# Altium project AuxillaryTester.PrjPcb
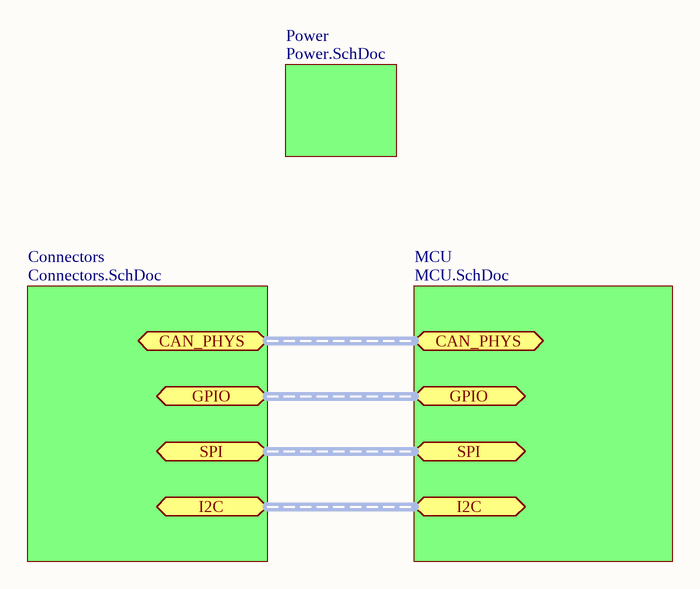
[diagram p0: Main.SchDoc]
4 sheets, 40 parts. Net scope: flat (ports and power ports of the same name join across sheets).
Board file: AuxTester.PcbDoc
Sheets:
  Main.SchDoc
    MCU = MCU.SchDoc
    Connectors = Connectors.SchDoc
    Power = Power.SchDoc

## Sheet Main.SchDoc
size Letter

### Sub-sheets
Connectors = Connectors.SchDoc: no entries
MCU = MCU.SchDoc: no entries
Power = Power.SchDoc: no entries

### Ports
CAN_PHYS (harness CAN_PHYS), GPIO (harness GPIO), I2C (harness I2C), SPI (harness SPI)

## Sheet MCU.SchDoc
size Letter
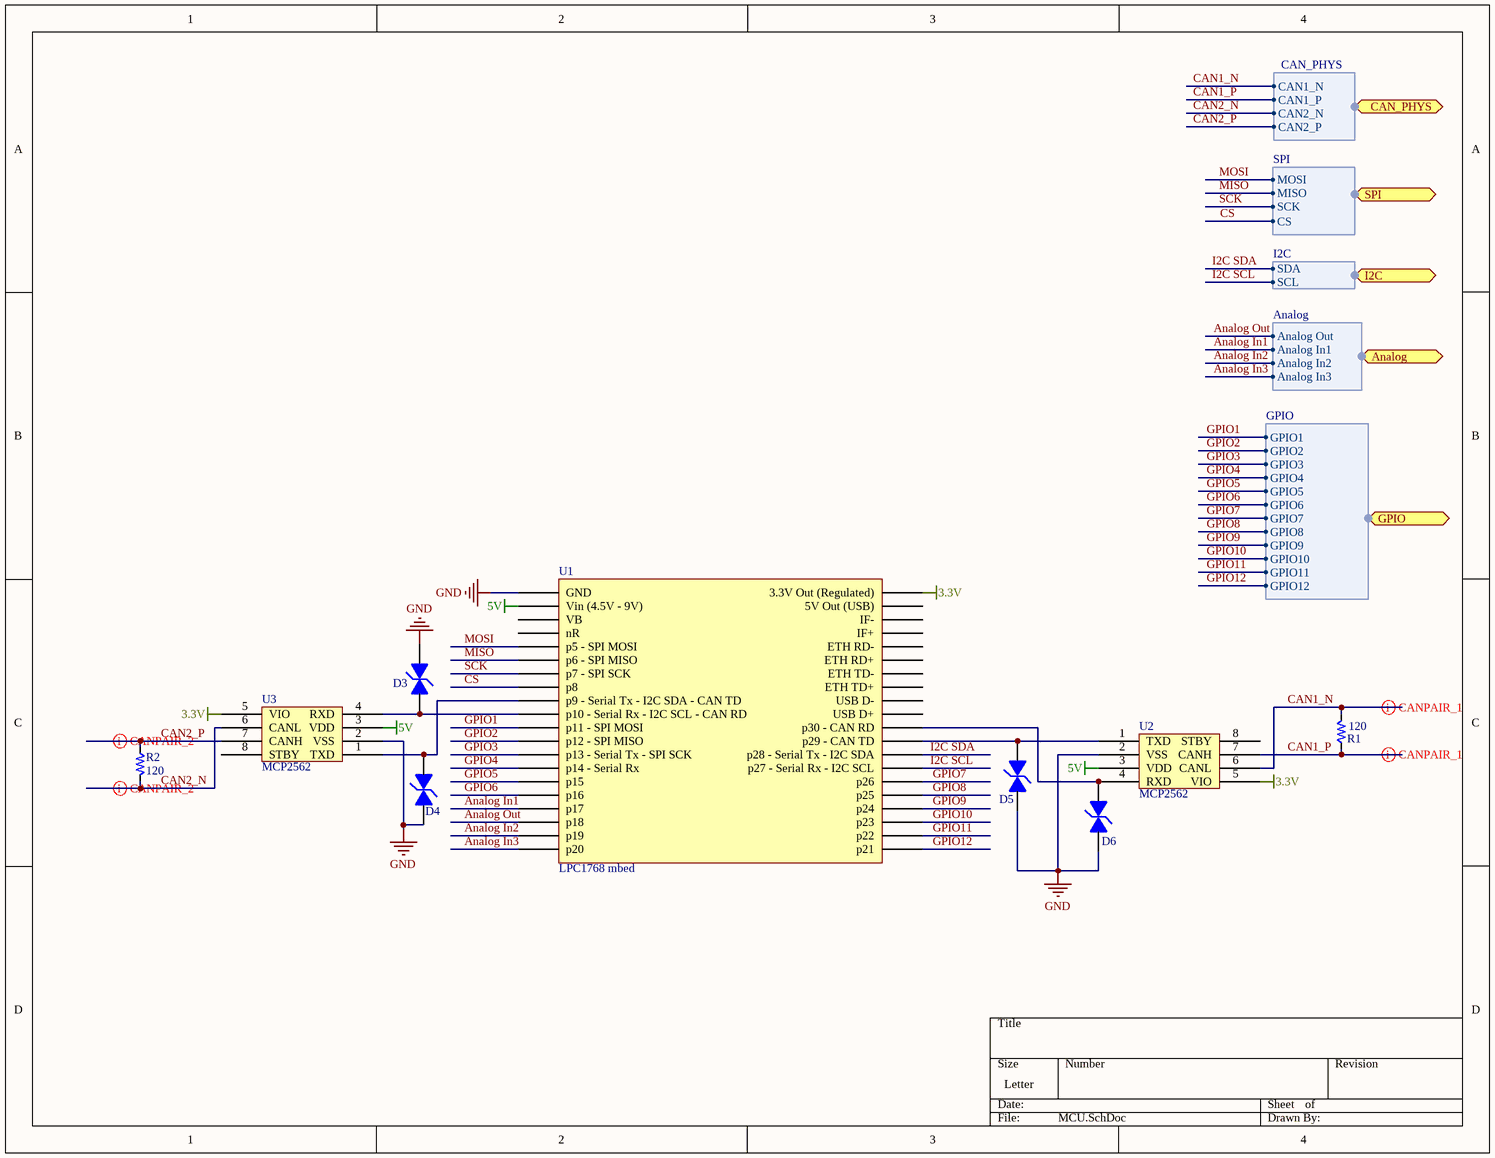
[diagram p1: MCU.SchDoc]

### Parts
D3  TVS Diode  [TVS Diode]  (value not drawn)
D4  TVS Diode  [TVS Diode]  (value not drawn)
D5  TVS Diode  [TVS Diode]  (value not drawn)
D6  TVS Diode  [TVS Diode]  (value not drawn)
R1  120  [PCB_GENERIC_SMD_0603]
R2  120  [PCB_GENERIC_SMD_0603]
U1  LPC1768 mbed  [LPC 1768 mbed Layout]
U2  MCP2562  [MCP2562]
U3  MCP2562  [MCP2562]

### Ports
Analog (harness Analog), CAN_PHYS (harness CAN_PHYS), GPIO (harness GPIO), I2C (harness I2C), SPI (harness SPI)

### Harnesses
CAN_PHYS: CAN1_N, CAN1_P, CAN2_N, CAN2_P
SPI: MOSI, MISO, SCK, CS
I2C: SDA, SCL
GPIO: GPIO1, GPIO2, GPIO3, GPIO4, GPIO5, GPIO6, GPIO7, GPIO8, GPIO9, GPIO10, GPIO11, GPIO12
Analog: Analog Out, Analog In1, Analog In2, Analog In3

### Nets
3.3V: U1.40(3.3V_Out_(Regulated)) U2.5(VIO) U3.5(VIO)
5V: U1.2(Vin_(4.5V_-_9V)) U2.3(VDD) U3.3(VDD)
GND: D3.2 D4.2 D5.1 D6.1 U1.1(GND) U2.2(VSS) U3.2(VSS)
Analog In1: U1.17(p17) ; port Analog.Analog In1
Analog In2: U1.19(p19) ; port Analog.Analog In2
Analog In3: U1.20(p20) ; port Analog.Analog In3
Analog Out: U1.18(p18) ; port Analog.Analog Out
CAN1_N: R1.2 U2.6(CANL) ; port CAN_PHYS.CAN1_N
CAN1_P: R1.1 U2.7(CANH) ; port CAN_PHYS.CAN1_P
CAN2_N: R2.2 U3.6(CANL) ; port CAN_PHYS.CAN2_N
CAN2_P: R2.1 U3.7(CANH) ; port CAN_PHYS.CAN2_P
CS: U1.8(p8) ; port SPI.CS
GPIO1: U1.11(p11_-_SPI_MOSI) ; port GPIO.GPIO1
GPIO2: U1.12(p12_-_SPI_MISO) ; port GPIO.GPIO2
GPIO3: U1.13(p13_-_Serial_Tx_-_SPI_SCK) ; port GPIO.GPIO3
GPIO4: U1.14(p14_-_Serial_Rx) ; port GPIO.GPIO4
GPIO5: U1.15(p15) ; port GPIO.GPIO5
GPIO6: U1.16(p16) ; port GPIO.GPIO6
GPIO7: U1.26(p26) ; port GPIO.GPIO7
GPIO8: U1.25(p25) ; port GPIO.GPIO8
GPIO9: U1.24(p24) ; port GPIO.GPIO9
GPIO10: U1.23(p23) ; port GPIO.GPIO10
GPIO11: U1.22(p22) ; port GPIO.GPIO11
GPIO12: U1.21(p21) ; port GPIO.GPIO12
I2C SCL: U1.27(p27_-_Serial_Rx_-_I2C_SCL) ; port I2C.SCL
I2C SDA: U1.28(p28_-_Serial_Tx_-_I2C_SDA) ; port I2C.SDA
MISO: U1.6(p6_-_SPI_MISO) ; port SPI.MISO
MOSI: U1.5(p5_-_SPI_MOSI) ; port SPI.MOSI
SCK: U1.7(p7_-_SPI_SCK) ; port SPI.SCK
NetD3_1: D3.1 U1.10(p10_-_Serial_Rx_-_I2C_SCL_-_CAN_RD) U3.4(RXD)
NetD4_1: D4.1 U1.9(p9_-_Serial_Tx_-_I2C_SDA_-_CAN_TD) U3.1(TXD)
NetD5_2: D5.2 U1.29(p29_-_CAN_TD) U2.1(TXD)
NetD6_2: D6.2 U1.30(p30_-_CAN_RD) U2.4(RXD)

Not connected (* = marked no-connect by the designer): U1 3(VB) 4(nR) 31(USB_D+) 32(USB_D-) 33(ETH_TD+) 34(ETH_TD-) 35(ETH_RD+) 36(ETH_RD-) 37(IF+) 38(IF-) 39(5V_Out_(USB)); U2 8(STBY); U3 8(STBY)

### Layout directives
differential pair: CAN1_N, CAN1_P, CAN2_N, CAN2_P

### Library data of the parts
D3-D6 = TVS Diode: Manufacturer: Bourns; Manufacturer ID: CDSOD323-T03SC
R1 R2 = SCH_GENERIC_RESISTOR_0603: 120 Ohms; Resistance: 120

## Sheet Connectors.SchDoc
size Letter
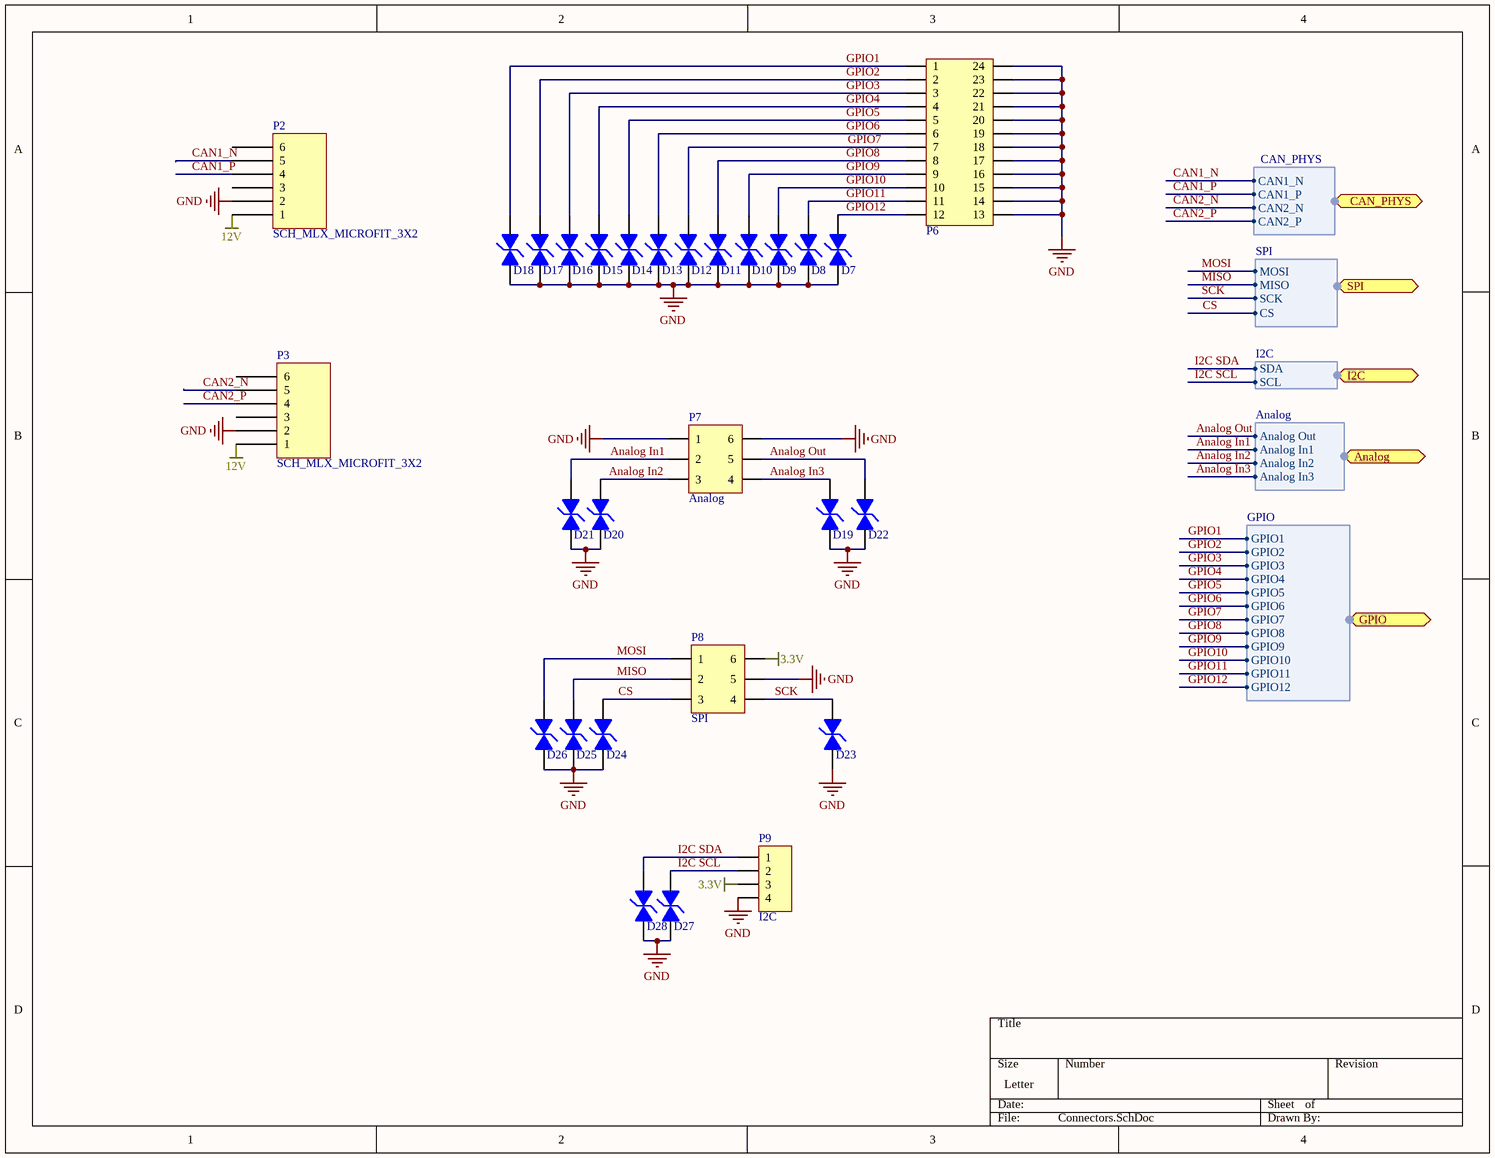
[diagram p2: Connectors.SchDoc]

### Parts
D7  TVS Diode  [TVS Diode]  (value not drawn)
D8  TVS Diode  [TVS Diode]  (value not drawn)
D9  TVS Diode  [TVS Diode]  (value not drawn)
D10  TVS Diode  [TVS Diode]  (value not drawn)
D11  TVS Diode  [TVS Diode]  (value not drawn)
D12  TVS Diode  [TVS Diode]  (value not drawn)
D13  TVS Diode  [TVS Diode]  (value not drawn)
D14  TVS Diode  [TVS Diode]  (value not drawn)
D15  TVS Diode  [TVS Diode]  (value not drawn)
D16  TVS Diode  [TVS Diode]  (value not drawn)
D17  TVS Diode  [TVS Diode]  (value not drawn)
D18  TVS Diode  [TVS Diode]  (value not drawn)
D19  TVS Diode  [TVS Diode]  (value not drawn)
D20  TVS Diode  [TVS Diode]  (value not drawn)
D21  TVS Diode  [TVS Diode]  (value not drawn)
D22  TVS Diode  [TVS Diode]  (value not drawn)
D23  TVS Diode  [TVS Diode]  (value not drawn)
D24  TVS Diode  [TVS Diode]  (value not drawn)
D25  TVS Diode  [TVS Diode]  (value not drawn)
D26  TVS Diode  [TVS Diode]  (value not drawn)
D27  TVS Diode  [TVS Diode]  (value not drawn)
D28  TVS Diode  [TVS Diode]  (value not drawn)
P2  SCH_MLX_MICROFIT_3X2  [PCB_MLX_MICROFIT_3X2]
P3  SCH_MLX_MICROFIT_3X2  [PCB_MLX_MICROFIT_3X2]
P6  24-Pin Vertical Header  [24-Pin Vertical Header]  (value not drawn)
P7  Analog  [6-Pin Vertical Header]
P8  SPI  [6-Pin Vertical Header]
P9  I2C  [4-Pin Vertical Header]

### Ports
Analog (harness Analog), CAN_PHYS (harness CAN_PHYS), GPIO (harness GPIO), I2C (harness I2C), SPI (harness SPI)

### Harnesses
CAN_PHYS: CAN1_N, CAN1_P, CAN2_N, CAN2_P
I2C: SDA, SCL
Analog: Analog Out, Analog In1, Analog In2, Analog In3
GPIO: GPIO1, GPIO2, GPIO3, GPIO4, GPIO5, GPIO6, GPIO7, GPIO8, GPIO9, GPIO10, GPIO11, GPIO12
SPI: MOSI, MISO, SCK, CS

### Nets
3.3V: P8.6 P9.3
12V: P2.1 P3.1
GND: D7.2 D8.2 D9.2 D10.2 D11.2 D12.2 D13.2 D14.2 D15.2 D16.2 D17.2 D18.2 D19.2 D20.2 D21.2 D22.2 D23.2 D24.2 D25.2 D26.2 D27.2 D28.2 P2.2 P3.2 P6.13 P6.14 P6.15 P6.16 P6.17 P6.18 P6.19 P6.20 P6.21 P6.22 P6.23 P6.24 P7.1 P7.6 P8.5 P9.4
Analog In1: D21.1 P7.2 ; port Analog.Analog In1
Analog In2: D20.1 P7.3 ; port Analog.Analog In2
Analog In3: D19.1 P7.4 ; port Analog.Analog In3
Analog Out: D22.1 P7.5 ; port Analog.Analog Out
CAN1_N: P2.5 ; port CAN_PHYS.CAN1_N
CAN1_P: P2.4 ; port CAN_PHYS.CAN1_P
CAN2_N: P3.5 ; port CAN_PHYS.CAN2_N
CAN2_P: P3.4 ; port CAN_PHYS.CAN2_P
CS: D24.1 P8.3 ; port SPI.CS
GPIO1: D18.1 P6.1 ; port GPIO.GPIO1
GPIO2: D17.1 P6.2 ; port GPIO.GPIO2
GPIO3: D16.1 P6.3 ; port GPIO.GPIO3
GPIO4: D15.1 P6.4 ; port GPIO.GPIO4
GPIO5: D14.1 P6.5 ; port GPIO.GPIO5
GPIO6: D13.1 P6.6 ; port GPIO.GPIO6
GPIO7: D12.1 P6.7 ; port GPIO.GPIO7
GPIO8: D11.1 P6.8 ; port GPIO.GPIO8
GPIO9: D10.1 P6.9 ; port GPIO.GPIO9
GPIO10: D9.1 P6.10 ; port GPIO.GPIO10
GPIO11: D8.1 P6.11 ; port GPIO.GPIO11
GPIO12: D7.1 P6.12 ; port GPIO.GPIO12
I2C SCL: D27.1 P9.2 ; port I2C.SCL
I2C SDA: D28.1 P9.1 ; port I2C.SDA
MISO: D25.1 P8.2 ; port SPI.MISO
MOSI: D26.1 P8.1 ; port SPI.MOSI
SCK: D23.1 P8.4 ; port SPI.SCK

Not connected (* = marked no-connect by the designer): P2 3 6; P3 3 6

### Library data of the parts
D7-D28 = TVS Diode: as D3 on sheet MCU
P6 = 24-Pin Vertical Header: Manufacturer: Sullins; Manufacturer No.: PPPC132LFBN-RC
P7 P8 = 6-Pin Vertical Header: Manufacturer: Sullins; Manufacturer ID: PPPC032LFBN-RC
P9 = 4-Pin Vertical Header: Manufacturer: Sullins; Manufacturer No.: PPPC041LFBN-RC

## Sheet Power.SchDoc
size Letter
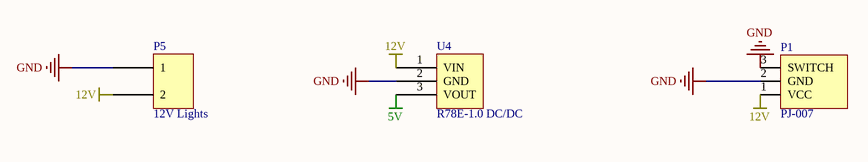
[diagram p3: Power.SchDoc]

### Parts
P1  PJ-007  [BARREL JACK PJ007]
P5  12V Lights  [Molex Mini-Fit Jr 2x1]
U4  R78E-1.0 DC/DC  [R78-1.0]

### Nets
5V: U4.3(VOUT)
12V: P1.1(VCC) P5.2 U4.1(VIN)
GND: P1.2(GND) P1.3(SWITCH) P5.1 U4.2(GND)

### Library data of the parts
P1 = Component_1
P5 = Molex Mini-Fit 1x2
U4 = R78E-1.0

## Nets that join several sheets
3.3V: MCU (U1.40 U2.5 U3.5), Connectors (P8.6 P9.3)
5V: MCU (U1.2 U2.3 U3.3), Power (U4.3)
12V: Connectors (P2.1 P3.1), Power (P1.1 P5.2 U4.1)
GND: MCU (7 pins), Connectors (40 pins), Power (P1.2 P1.3 P5.1 U4.2)
Analog In1: MCU (U1.17), Connectors (D21.1 P7.2)
Analog In2: MCU (U1.19), Connectors (D20.1 P7.3)
Analog In3: MCU (U1.20), Connectors (D19.1 P7.4)
Analog Out: MCU (U1.18), Connectors (D22.1 P7.5)
CAN1_N: MCU (R1.2 U2.6), Connectors (P2.5)
CAN1_P: MCU (R1.1 U2.7), Connectors (P2.4)
CAN2_N: MCU (R2.2 U3.6), Connectors (P3.5)
CAN2_P: MCU (R2.1 U3.7), Connectors (P3.4)
CS: MCU (U1.8), Connectors (D24.1 P8.3)
GPIO1: MCU (U1.11), Connectors (D18.1 P6.1)
GPIO2: MCU (U1.12), Connectors (D17.1 P6.2)
GPIO3: MCU (U1.13), Connectors (D16.1 P6.3)
GPIO4: MCU (U1.14), Connectors (D15.1 P6.4)
GPIO5: MCU (U1.15), Connectors (D14.1 P6.5)
GPIO6: MCU (U1.16), Connectors (D13.1 P6.6)
GPIO7: MCU (U1.26), Connectors (D12.1 P6.7)
GPIO8: MCU (U1.25), Connectors (D11.1 P6.8)
GPIO9: MCU (U1.24), Connectors (D10.1 P6.9)
GPIO10: MCU (U1.23), Connectors (D9.1 P6.10)
GPIO11: MCU (U1.22), Connectors (D8.1 P6.11)
GPIO12: MCU (U1.21), Connectors (D7.1 P6.12)
I2C SCL: MCU (U1.27), Connectors (D27.1 P9.2)
I2C SDA: MCU (U1.28), Connectors (D28.1 P9.1)
MISO: MCU (U1.6), Connectors (D25.1 P8.2)
MOSI: MCU (U1.5), Connectors (D26.1 P8.1)
SCK: MCU (U1.7), Connectors (D23.1 P8.4)